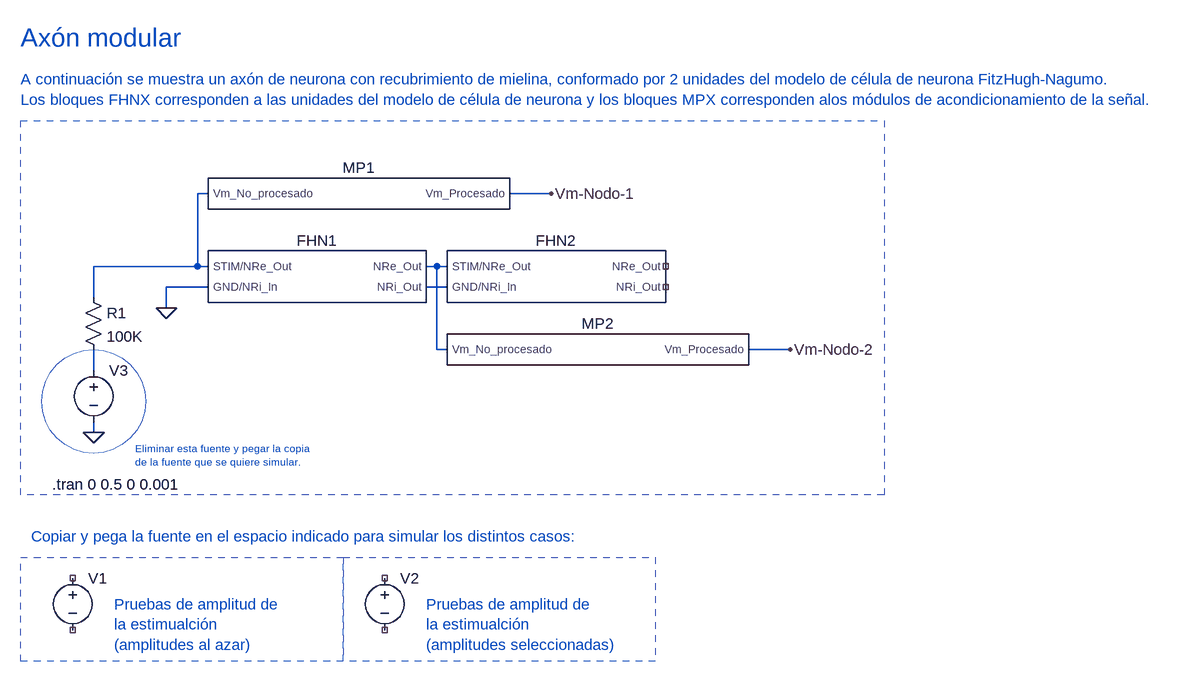
[diagram p0: schematic Axon-Modular - 2 Unidades.asc]
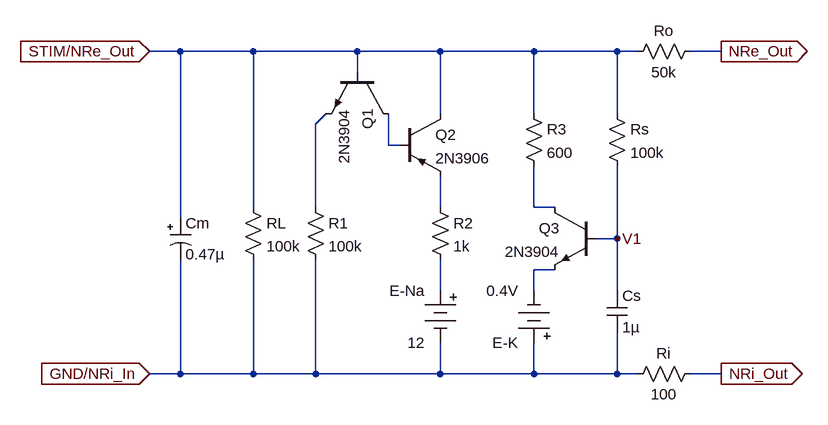
[diagram p1: sub-circuit unidad-de-neurona-fhn.asc]
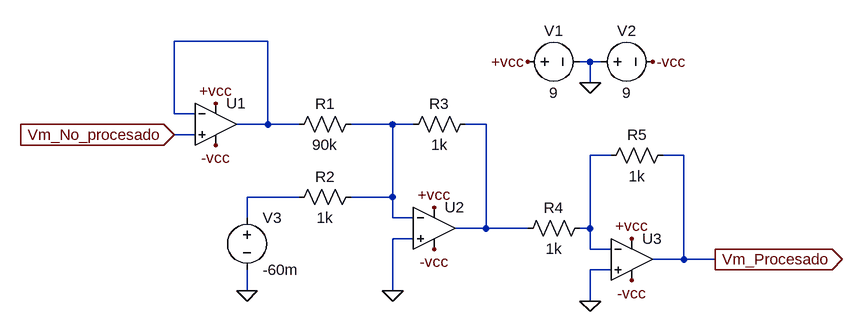
[diagram p2: sub-circuit modulo-procesamiento.asc]
Axon-Modular - 2 Unidades.asc, the LTspice schematic file:
Version 4
SHEET 1 6732 740
WIRE 352 16 336 16
WIRE 880 16 816 16
WIRE 336 128 336 16
WIRE 336 128 176 128
WIRE 352 128 336 128
WIRE 704 128 688 128
WIRE 720 128 704 128
WIRE 352 160 288 160
WIRE 720 160 688 160
WIRE 176 176 176 128
WIRE 288 192 288 160
WIRE 704 256 704 128
WIRE 720 256 704 256
WIRE 1248 256 1184 256
WIRE 176 288 176 256
WIRE 176 384 176 368
FLAG 176 384 0
FLAG 288 192 0
FLAG 880 16 Vm-Nodo-1
FLAG 1248 256 Vm-Nodo-2
SYMBOL Unidad-de-Neurona-FHN 512 144 R0
SYMATTR InstName FHN1
SYMBOL Unidad-de-Neurona-FHN 880 144 R0
SYMATTR InstName FHN2
SYMBOL voltage 144 592 R0
WINDOW 123 0 0 Left 0
WINDOW 39 0 0 Left 0
WINDOW 3 24 44 Invisible 2
SYMATTR Value PWL(0 0 5m 0 5.0000001m 0.5 15m 0.5 15.000001m 0 40m 0 40.000001m 1 70m 1 70.00001m 0 130m 0 130.00001m 2 150m 2 150.00001m 0 190m 0 190.00001m 3 200m 3 200.00001m 0 240m 0 240.00001m 5 250m 5 250.00001m 0 290m 0 290.00001m 5 330m 5 330.00001m 0 350m 0 350.00001m 5 400m 5 400.00001m 0 430m 0 430.00001m 7 450m 7 450.00001m 0 480m 0 480.00001m 7 520m 7 520.00001m 0 550m 0 550.00001m 1 610m 1 610.00001m 0 700m 0 700.00001m 0.5 760m 0.5 760.00001m 0 780m 0 780.00001m 1 870.m 1 870.00001m 0)
SYMATTR InstName V1
SYMBOL res 160 160 R0
SYMATTR InstName R1
SYMATTR Value 100K
SYMBOL Modulo-Procesamiento 576 16 R0
SYMATTR InstName MP1
SYMBOL Modulo-Procesamiento 944 256 R0
SYMATTR InstName MP2
SYMBOL voltage 624 592 R0
WINDOW 123 0 0 Left 0
WINDOW 39 0 0 Left 0
WINDOW 3 24 44 Invisible 2
SYMATTR Value PWL(0 0 5m 0 5.0000001m 0.5 15m 0.5 15.000001m 0 70m 0 70.000001m 1 80m 1 80.000001m 0 135m 0 135.000001m 2 145m 2 145.000001m 0 200m 0 200.000001m 3 210m 3 210.000001m 0 265m 0 265.000001m 4 275m 4 275.000001m 0 330m 0 330.00001m 5 340m 5 340.000001m 0)
SYMATTR InstName V2
SYMBOL voltage 176 272 R0
WINDOW 123 0 0 Left 0
WINDOW 39 0 0 Left 0
WINDOW 3 24 44 Invisible 2
SYMATTR Value PWL(0 0 5m 0 5.0000001m 0.5 15m 0.5 15.000001m 0 40m 0 40.000001m 1 70m 1 70.00001m 0 130m 0 130.00001m 2 150m 2 150.00001m 0 190m 0 190.00001m 3 200m 3 200.00001m 0 240m 0 240.00001m 5 250m 5 250.00001m 0 290m 0 290.00001m 5 330m 5 330.00001m 0 350m 0 350.00001m 5 400m 5 400.00001m 0 430m 0 430.00001m 7 450m 7 450.00001m 0 480m 0 480.00001m 7 520m 7 520.00001m 0 550m 0 550.00001m 1 610m 1 610.00001m 0 700m 0 700.00001m 0.5 760m 0.5 760.00001m 0 780m 0 780.00001m 1 870.m 1 870.00001m 0)
SYMATTR InstName V3
TEXT 112 464 Left 2 !.tran 0 0.5 0 0.001
TEXT 64 -224 Left 4 ;Axón modular
TEXT 208 648 Left 2 ;Pruebas de amplitud de \nla estimualción\n(amplitudes al azar)
TEXT 688 648 Left 2 ;Pruebas de amplitud de \nla estimualción\n(amplitudes seleccionadas)
TEXT 80 544 Left 2 ;Copiar y pega la fuente en el espacio indicado para simular los distintos casos:
TEXT 64 -160 Left 2 ;A continuación se muestra un axón de neurona con recubrimiento de mielina, conformado por 2 unidades del modelo de célula de neurona FitzHugh-Nagumo.\nLos bloques FHNX corresponden a las unidades del modelo de célula de neurona y los bloques MPX corresponden alos módulos de acondicionamiento de la señal.
TEXT 240 408 Left 1 ;Eliminar esta fuente y pegar la copia \nde la fuente que se quiere simular.
RECTANGLE Normal 1392 480 64 -96 2
RECTANGLE Normal 560 736 64 576 2
RECTANGLE Normal 1040 736 560 576 2
CIRCLE Normal 256 416 96 256 2

unidad-de-neurona-fhn.asc, the sub-circuit schematic file:
Version 4
SHEET 1 1332 680
WIRE -368 -96 -416 -96
WIRE -256 -96 -368 -96
WIRE -96 -96 -256 -96
WIRE 32 -96 -96 -96
WIRE 176 -96 32 -96
WIRE 304 -96 176 -96
WIRE 336 -96 304 -96
WIRE 464 -96 416 -96
WIRE -96 -64 -96 -96
WIRE 32 0 32 -96
WIRE 176 0 176 -96
WIRE 304 0 304 -96
WIRE -160 16 -144 0
WIRE -48 48 -48 0
WIRE -32 48 -48 48
WIRE -256 144 -256 -96
WIRE -160 144 -160 16
WIRE 32 144 32 96
WIRE 176 144 176 80
WIRE 208 144 176 144
WIRE -368 160 -368 -96
WIRE 304 192 304 80
WIRE 304 192 272 192
WIRE 208 240 176 240
WIRE 32 272 32 224
WIRE 176 272 176 240
WIRE 304 272 304 192
WIRE -368 400 -368 224
WIRE -368 400 -416 400
WIRE -256 400 -256 224
WIRE -256 400 -368 400
WIRE -160 400 -160 224
WIRE -160 400 -256 400
WIRE 32 400 32 352
WIRE 32 400 -160 400
WIRE 176 400 176 352
WIRE 176 400 32 400
WIRE 304 400 304 336
WIRE 304 400 176 400
WIRE 336 400 304 400
WIRE 464 400 416 400
FLAG -416 -96 STIM/NRe_Out
IOPIN -416 -96 In
FLAG -416 400 GND/NRi_In
IOPIN -416 400 In
FLAG 464 -96 NRe_Out
IOPIN 464 -96 Out
FLAG 464 400 NRi_Out
IOPIN 464 400 Out
FLAG 304 192 V1
SYMBOL res -272 128 R0
SYMATTR InstName RL
SYMATTR Value 100k
SYMBOL res -176 128 R0
SYMATTR InstName R1
SYMATTR Value 100k
SYMBOL res 288 -16 R0
SYMATTR InstName Rs
SYMATTR Value 100k
SYMBOL cap 288 272 R0
SYMATTR InstName Cs
SYMATTR Value 1µ
SYMBOL npn -48 -64 R90
SYMATTR InstName Q1
SYMATTR Value 2N3904
SYMBOL pnp -32 0 R0
SYMATTR InstName Q2
SYMATTR Value 2N3906
SYMBOL Misc\\battery 32 256 M0
WINDOW 123 0 0 Left 0
WINDOW 39 0 0 Left 0
SYMATTR InstName E-Na
SYMATTR Value 12
SYMBOL npn 272 144 M0
SYMATTR InstName Q3
SYMATTR Value 2N3904
SYMBOL res 16 128 R0
SYMATTR InstName R2
SYMATTR Value 1k
SYMBOL polcap -384 160 R0
SYMATTR InstName Cm
SYMATTR Value 0.47µ
SYMBOL res 160 -16 R0
SYMATTR InstName R3
SYMATTR Value 600
SYMBOL res 432 -112 R90
WINDOW 0 0 56 VBottom 2
WINDOW 3 32 56 VTop 2
SYMATTR InstName Ro
SYMATTR Value 50k
SYMBOL res 432 384 R90
WINDOW 0 0 56 VBottom 2
WINDOW 3 32 56 VTop 2
SYMATTR InstName Ri
SYMATTR Value 100
SYMBOL Misc\\battery 176 368 R180
WINDOW 123 0 0 Left 0
WINDOW 39 0 0 Left 0
SYMATTR InstName E-K
SYMATTR Value 0.4V

modulo-procesamiento.asc, the sub-circuit schematic file:
Version 4
SHEET 1 2272 680
WIRE 1264 -112 1120 -112
WIRE 1760 -80 1744 -80
WIRE 1776 -80 1760 -80
WIRE 1760 -48 1760 -80
WIRE 1120 0 1120 -112
WIRE 1152 0 1120 0
WIRE 1264 16 1264 -112
WIRE 1264 16 1216 16
WIRE 1312 16 1264 16
WIRE 1456 16 1392 16
WIRE 1488 16 1456 16
WIRE 1600 16 1568 16
WIRE 1152 32 1120 32
WIRE 1792 64 1760 64
WIRE 1904 64 1872 64
WIRE 1312 128 1232 128
WIRE 1456 128 1456 16
WIRE 1456 128 1392 128
WIRE 1232 160 1232 128
WIRE 1456 160 1456 128
WIRE 1488 160 1456 160
WIRE 1600 176 1600 16
WIRE 1600 176 1552 176
WIRE 1664 176 1600 176
WIRE 1760 176 1760 64
WIRE 1760 176 1744 176
WIRE 1488 192 1456 192
WIRE 1760 208 1760 176
WIRE 1792 208 1760 208
WIRE 1904 224 1904 64
WIRE 1904 224 1856 224
WIRE 1952 224 1904 224
WIRE 1792 240 1760 240
WIRE 1232 272 1232 240
WIRE 1456 272 1456 192
WIRE 1760 288 1760 240
FLAG 1760 -48 0
FLAG 1664 -80 +vcc
FLAG 1856 -80 -vcc
FLAG 1184 -16 +vcc
FLAG 1184 48 -vcc
FLAG 1456 272 0
FLAG 1232 272 0
FLAG 1520 208 -vcc
FLAG 1520 144 +vcc
FLAG 1824 256 -vcc
FLAG 1824 192 +vcc
FLAG 1760 288 0
FLAG 1952 224 Vm_Procesado
IOPIN 1952 224 Out
FLAG 1120 32 Vm_No_procesado
IOPIN 1120 32 In
SYMBOL OpAmps\\UniversalOpAmp 1184 16 R0
SYMATTR InstName U1
SYMBOL OpAmps\\UniversalOpAmp 1520 176 R0
SYMATTR InstName U2
SYMBOL OpAmps\\UniversalOpAmp 1824 224 R0
SYMATTR InstName U3
SYMBOL res 1408 0 R90
WINDOW 0 0 56 VBottom 2
WINDOW 3 32 56 VTop 2
SYMATTR InstName R1
SYMATTR Value 90k
SYMBOL res 1408 112 R90
WINDOW 0 0 56 VBottom 2
WINDOW 3 32 56 VTop 2
SYMATTR InstName R2
SYMATTR Value 1k
SYMBOL res 1760 160 R90
WINDOW 0 0 56 VBottom 2
WINDOW 3 32 56 VTop 2
SYMATTR InstName R4
SYMATTR Value 1k
SYMBOL res 1584 0 R90
WINDOW 0 0 56 VBottom 2
WINDOW 3 32 56 VTop 2
SYMATTR InstName R3
SYMATTR Value 1k
SYMBOL voltage 1648 -80 R270
WINDOW 0 32 56 VTop 2
WINDOW 3 -32 56 VBottom 2
WINDOW 123 0 0 Left 0
WINDOW 39 0 0 Left 0
SYMATTR InstName V1
SYMATTR Value 9
SYMBOL voltage 1760 -80 R270
WINDOW 0 32 56 VTop 2
WINDOW 3 -32 56 VBottom 2
WINDOW 123 0 0 Left 0
WINDOW 39 0 0 Left 0
SYMATTR InstName V2
SYMATTR Value 9
SYMBOL res 1888 48 R90
WINDOW 0 0 56 VBottom 2
WINDOW 3 32 56 VTop 2
SYMATTR InstName R5
SYMATTR Value 1k
SYMBOL voltage 1232 144 R0
WINDOW 123 0 0 Left 0
WINDOW 39 0 0 Left 0
SYMATTR InstName V3
SYMATTR Value -60m

The netlist it stands for:
* Axon-Modular - 2 Unidades.asc
XFHN1 0 N001 N002 N003 unidad-de-neurona-fhn
XFHN2 N003 N002 NC_01 NC_02 unidad-de-neurona-fhn
V1 NC_03 NC_04 PWL(0 0 5m 0 5.0000001m 0.5 15m 0.5 15.000001m 0 40m 0 40.000001m 1 70m 1 70.00001m 0 130m 0 130.00001m 2 150m 2 150.00001m 0 190m 0 190.00001m 3 200m 3 200.00001m 0 240m 0 240.00001m 5 250m 5 250.00001m 0 290m 0 290.00001m 5 330m 5 330.00001m 0 350m 0 350.00001m 5 400m 5 400.00001m 0 430m 0 430.00001m 7 450m 7 450.00001m 0 480m 0 480.00001m 7 520m 7 520.00001m 0 550m 0 550.00001m 1 610m 1 610.00001m 0 700m 0 700.00001m 0.5 760m 0.5 760.00001m 0 780m 0 780.00001m 1 870.m 1 870.00001m 0)
R1 N001 N004 100K
XMP1 N001 Vm-Nodo-1 modulo-procesamiento
XMP2 N002 Vm-Nodo-2 modulo-procesamiento
V2 NC_05 NC_06 PWL(0 0 5m 0 5.0000001m 0.5 15m 0.5 15.000001m 0 70m 0 70.000001m 1 80m 1 80.000001m 0 135m 0 135.000001m 2 145m 2 145.000001m 0 200m 0 200.000001m 3 210m 3 210.000001m 0 265m 0 265.000001m 4 275m 4 275.000001m 0 330m 0 330.00001m 5 340m 5 340.000001m 0)
V3 N004 0 PWL(0 0 5m 0 5.0000001m 0.5 15m 0.5 15.000001m 0 40m 0 40.000001m 1 70m 1 70.00001m 0 130m 0 130.00001m 2 150m 2 150.00001m 0 190m 0 190.00001m 3 200m 3 200.00001m 0 240m 0 240.00001m 5 250m 5 250.00001m 0 290m 0 290.00001m 5 330m 5 330.00001m 0 350m 0 350.00001m 5 400m 5 400.00001m 0 430m 0 430.00001m 7 450m 7 450.00001m 0 480m 0 480.00001m 7 520m 7 520.00001m 0 550m 0 550.00001m 1 610m 1 610.00001m 0 700m 0 700.00001m 0.5 760m 0.5 760.00001m 0 780m 0 780.00001m 1 870.m 1 870.00001m 0)

* block symbol definitions
.subckt unidad-de-neurona-fhn GND/NRi_In STIM/NRe_Out NRe_Out NRi_Out
RL STIM/NRe_Out GND/NRi_In 100k
R1 N001 GND/NRi_In 100k
Rs STIM/NRe_Out V1 100k
Cs V1 GND/NRi_In 1µ
Q1 N002 STIM/NRe_Out N001 0 2N3904
Q2 STIM/NRe_Out N002 N003 0 2N3906
V§E-Na N006 GND/NRi_In 12
Q3 N004 V1 N005 0 2N3904
R2 N003 N006 1k
Cm STIM/NRe_Out GND/NRi_In 0.47µ
R3 STIM/NRe_Out N004 600
Ro NRe_Out STIM/NRe_Out 50k
Ri NRi_Out GND/NRi_In 100
V§E-K GND/NRi_In N005 0.4V
.ends unidad-de-neurona-fhn

.subckt modulo-procesamiento Vm_No_procesado Vm_Procesado
XU1 Vm_No_procesado N001 +vcc -vcc N001 level1 Avol=1Meg GBW=10Meg Vos=0 En=0 Enk=0 In=0 Ink=0 Rin=500Meg  ; pins In+ In- V+ V- OUT
XU2 0 N002 +vcc -vcc N003 level1 Avol=1Meg GBW=10Meg Vos=0 En=0 Enk=0 In=0 Ink=0 Rin=500Meg  ; pins In+ In- V+ V- OUT
XU3 0 N004 +vcc -vcc Vm_Procesado level1 Avol=1Meg GBW=10Meg Vos=0 En=0 Enk=0 In=0 Ink=0 Rin=500Meg  ; pins In+ In- V+ V- OUT
R1 N002 N001 90k
R2 N002 N005 1k
R4 N004 N003 1k
R3 N003 N002 1k
V1 +vcc 0 9
V2 0 -vcc 9
R5 Vm_Procesado N004 1k
V3 N005 0 -60m
.ends modulo-procesamiento

.model NPN NPN
.model PNP PNP
.lib standard.bjt
.tran 0 0.5 0 0.001
* Axón modular
* Pruebas de amplitud de
* la estimualción
* (amplitudes al azar)
* Pruebas de amplitud de
* la estimualción
* (amplitudes seleccionadas)
* Copiar y pega la fuente en el espacio indicado para simular los distintos casos:
* A continuación se muestra un axón de neurona con recubrimiento de mielina, conformado por 2 unidades del modelo de célula de neurona FitzHugh-Nagumo.
* Los bloques FHNX corresponden a las unidades del modelo de célula de neurona y los bloques MPX corresponden alos módulos de acondicionamiento de la señal.
* Eliminar esta fuente y pegar la copia
* de la fuente que se quiere simular.
.lib UniversalOpAmp1.lib
.backanno
.end